# Altium schematic sheet power.SchDoc
size A4; SheetNumber: 3; SheetTotal: 4; SPICEModelCacheCMTQJRSB: <root> / <DocumentId>CMTQJRSB</DocumentId> / </root>
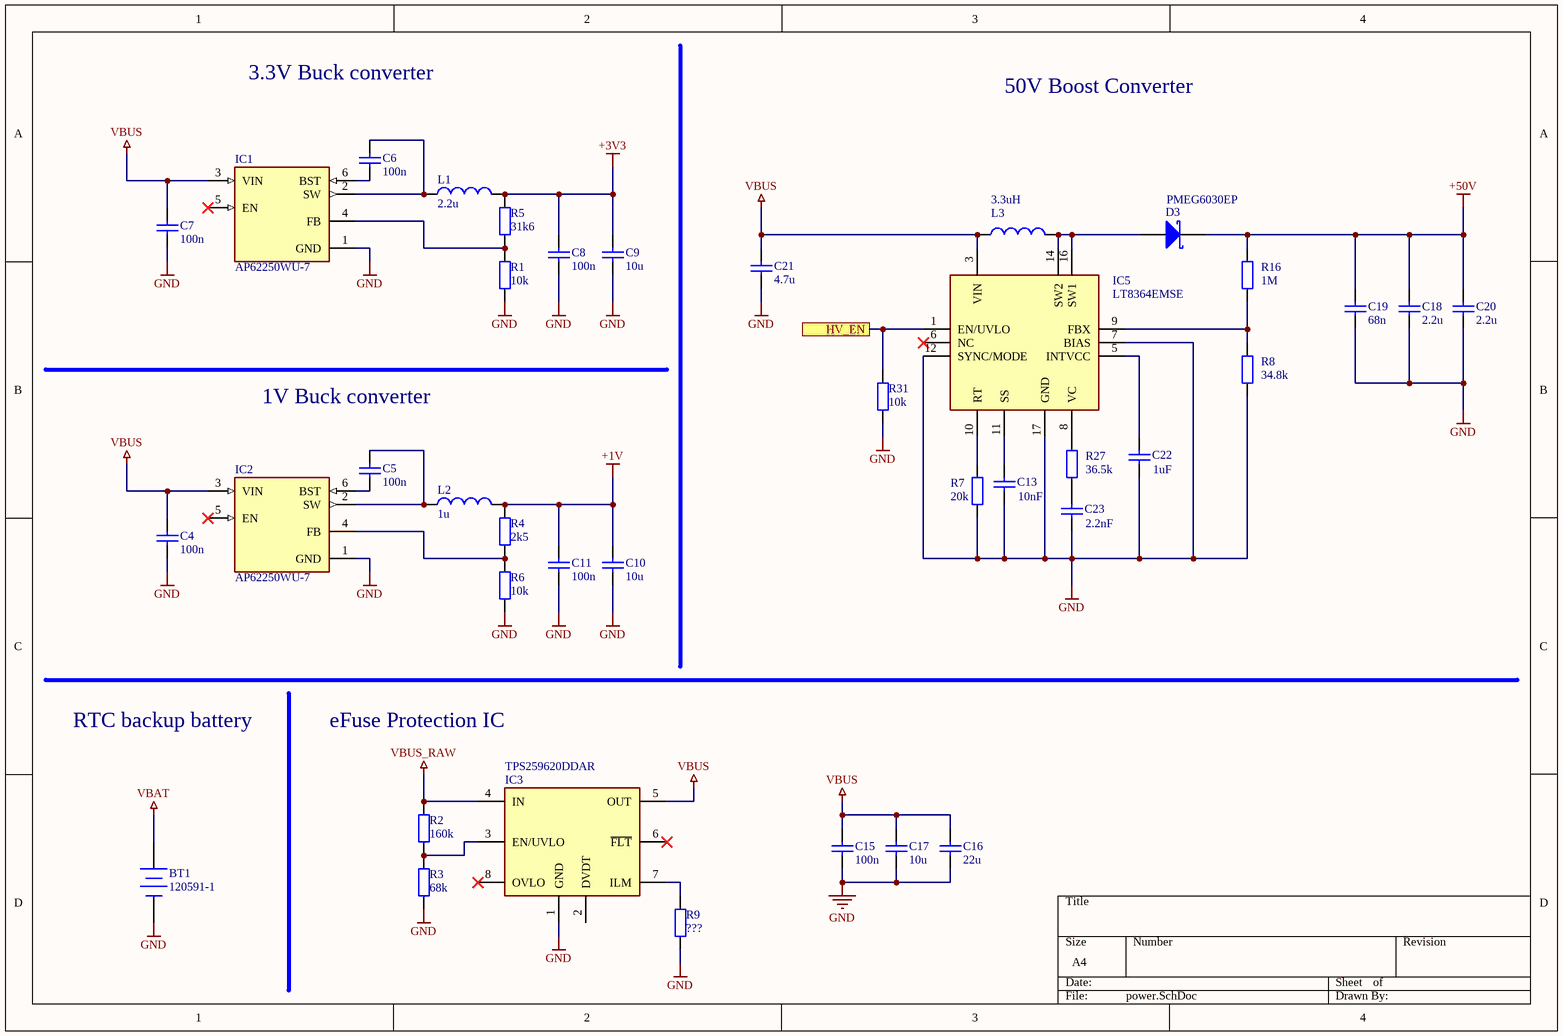
[diagram p0: power.SchDoc]

## Parts
BT1  120591-1  [BR1220_Horizontal]
C4  100n  [1608[0603]]
C5  100n  [1608[0603]]
C6  100n  [1608[0603]]
C7  100n  [1608[0603]]
C8  100n  [1608[0603]]
C9  10u  [1608[0603]]
C10  10u  [1608[0603]]
C11  100n  [1608[0603]]
C13  10nF  [1608[0603]]
C15  100n  [1608[0603]]
C16  22u  [1608[0603]]
C17  10u  [1608[0603]]
C18  2.2u  [C1210]
C19  68n  [1608[0603]]
C20  2.2u  [C1210]
C21  4.7u  [1608[0603]]
C22  1uF  [1608[0603]]
C23  2.2nF  [1608[0603]]
D3  PMEG6030EP  [PMEG6030EP115]
IC1  AP62250WU-7  [TSOT26]
IC2  AP62250WU-7  [TSOT26]
IC3  TPS259620DDAR  [SOIC127P600X170-9N]
IC5  LT8364EMSE  [LT8364EMSEPBF]
L1  2.2u  [BWVS004040182R2M00]
L2  1u  [BWVS004040182R2M00]
L3  3.3uH  [BWVS004040182R2M00]
R1  10k  [J1-0603]
R2  160k  [J1-0603]
R3  68k  [J1-0603]
R4  2k5  [J1-0603]
R5  31k6  [J1-0603]
R6  10k  [J1-0603]
R7  20k  [J1-0603]
R8  34.8k  [J1-0603]
R9  ???  [J1-0603]
R16  1M  [J1-0603]
R27  36.5k  [J1-0603]
R31  10k  [J1-0603]

## Ports
HV_EN (see main[2B])

## Nets
+1V: C10.2 C11.2 L2.2 R4.2
+3V3: C8.2 C9.2 L1.2 R5.2
+50V: C18.2 C19.2 C20.2 D3.2(K) R16.2
GND: BT1.1 C4.1 C7.1 C8.1 C9.1 C10.1 C11.1 C13.1 C15.1 C16.1 C17.1 C18.1 C19.1 C20.1 C21.1 C22.1 C23.1 IC1.1(GND) IC2.1(GND) IC3.1(GND) IC5.7(BIAS) IC5.12(SYNC/MODE) IC5.17(GND) R1.1 R3.1 R6.1 R7.1 R8.1 R9.1 R31.1
VBAT: BT1.2
VBUS: C4.2 C7.2 C15.2 C16.2 C17.2 C21.2 IC1.3(VIN) IC2.3(VIN) IC3.5(OUT) IC5.3(VIN) L3.1
VBUS_RAW: IC3.4(IN) R2.2
HV_EN: IC5.1(EN/UVLO) R31.2 ; port HV_EN
NetC5_1: C5.1 IC2.6(BST)
NetC5_2: C5.2 IC2.2(SW) L2.1
NetC6_1: C6.1 IC1.6(BST)
NetC6_2: C6.2 IC1.2(SW) L1.1
NetC13_2: C13.2 IC5.11(SS)
NetC22_2: C22.2 IC5.5(INTVCC)
NetC23_2: C23.2 R27.1
NetD3_1: D3.1(A) IC5.14(SW2) IC5.16(SW1) L3.2
NetIC1_4: IC1.4(FB) R1.2 R5.1
NetIC2_4: IC2.4(FB) R4.1 R6.2
NetIC3_3: IC3.3(EN/UVLO) R2.1 R3.2
NetIC3_7: IC3.7(ILM) R9.2
NetIC5_8: IC5.8(VC) R27.2
NetIC5_9: IC5.9(FBX) R8.2 R16.1
NetIC5_10: IC5.10(RT) R7.2

Not connected (* = marked no-connect by the designer): IC1 5(EN)*; IC2 5(EN)*; IC3 2(DVDT) 6(~{FLT})* 8(OVLO)*; IC5 6(NC)*

## Notes on the sheet
- 3.3V Buck converter
- 50V Boost Converter
- 1V Buck converter
- RTC backup battery
- eFuse Protection IC

## Library data of the parts
BT1 = 120591-1: Battery; Manufacturer_Name: TE Connectivity; Datasheet Link: http://www.te.com/commerce/DocumentDelivery/DDEController?Action=srchrtrv&DocNm=120591&DocType=Customer+Drawing&DocLang=English&DocFormat=pdf&PartCntxt=120591-1; Manufacturer_Part_Number: 120591-1; Mouser Part Number: 571-1205911; Mouser Price/Stock: https://www.mouser.co.uk/ProductDetail/TE-Connectivity/120591-1?qs=cB%252BprIo57OeZ1n1mnEiYEw%3D%3D; Arrow Part Number: 120591-1; Arrow Price/Stock: https://www.arrow.com/en/products/120591-1/te-connectivity?utm_currency=USD&region=nac
C4-C11 C13 C15-C23 = Cap: Capacitor; Value: 100pF; Published: 8-Jun-2000; LatestRevisionDate: 17-Jul-2002; LatestRevisionNote: Re-released for DXP Platform.; PackageReference: RAD-0.3; Publisher: Altium Limited; PackageDescription: Radial Cap, Thru-Hole; 2 Leads; 0.3 in Pin Spacing
D3 = PMEG6030EP: Schottky Diode; Published: 8-Jun-2000; LatestRevisionDate: 17-Jul-2002; LatestRevisionNote: Re-released for DXP Platform.; PackageReference: SMB; Publisher: Altium Limited; PackageDescription: DO-214-AA/SMB; 2 C-Bend Leads; Body 5.3 x 3.6 mm, inc. leads (LxW); Code_JEDEC: DO-214-AA
IC1 IC2 = AP62250WU-7: Integrated Circuit; Manufacturer_Name: Diodes Incorporated; Datasheet Link: https://www.diodes.com//assets/Datasheets/AP62250.pdf; Height: 1mm; Manufacturer_Part_Number: AP62250WU-7; Mouser Part Number: 621-AP62250WU-7; Mouser Price/Stock: https://www.mouser.co.uk/ProductDetail/Diodes-Incorporated/AP62250WU-7?qs=7MVldsJ5Uax1PUc8sdeimQ%3D%3D; Arrow Part Number: AP62250WU-7; Arrow Price/Stock: https://www.arrow.com/en/products/ap62250wu-7/diodes-incorporated?region=europe
IC3 = TPS259620DDAR: Integrated Circuit; Manufacturer_Name: Texas Instruments; Datasheet Link: https://www.ti.com/lit/gpn/TPS2596; Height: 1.7mm; Manufacturer_Part_Number: TPS259620DDAR; Mouser Part Number: 595-TPS259620DDAR; Mouser Price/Stock: https://www.mouser.co.uk/ProductDetail/Texas-Instruments/TPS259620DDAR?qs=XeJtXLiO41RogCpRV1l%252BSg%3D%3D; Arrow Part Number: TPS259620DDAR; Arrow Price/Stock: https://www.arrow.com/en/products/tps259620ddar/texas-instruments
IC5 = LT8364EMSE#PBF: Integrated Circuit; Manufacturer_Name: Analog Devices; Datasheet Link: https://www.analog.com/media/en/technical-documentation/data-sheets/lt8364.pdf; Height: 1.1mm; Manufacturer_Part_Number: LT8364EMSE#PBF; Mouser Part Number: 584-LT8364EMSEPBF; Mouser Price/Stock: https://www.mouser.co.uk/ProductDetail/Analog-Devices/LT8364EMSEPBF?qs=W0yvOO0ixfH269lPR9cWrw%3D%3D; Arrow Part Number: LT8364EMSE#PBF; Arrow Price/Stock: https://www.arrow.com/en/products/lt8364emsepbf/analog-devices?region=nac
L1 L2 = Inductor: Code_IEC: 1005; Value: 10mH; Published: 8-Jun-2000; LatestRevisionDate: 29-May-2009; LatestRevisionNote: IPC-7351 Footprint Added.; PackageReference: 0402-A; Publisher: Altium Limited; PackageDescription: Chip Inductor; Code_JEITA: 0402
L3 = Inductor: Code_IEC: 1005; Published: 8-Jun-2000; LatestRevisionDate: 29-May-2009; LatestRevisionNote: IPC-7351 Footprint Added.; PackageReference: 0402-A; Publisher: Altium Limited; PackageDescription: Chip Inductor; Code_JEITA: 0402; Value: 3.3uH
R1-R9 R16 R27 R31 = Res2: Resistor; Value: 1K; Published: 8-Jun-2000; LatestRevisionDate: 17-Jul-2002; LatestRevisionNote: Re-released for DXP Platform.; PackageReference: AXIAL-0.4; Publisher: Altium Limited; PackageDescription: Axial Device, Thru-Hole; 2 Leads; 0.4 in Pin Spacing